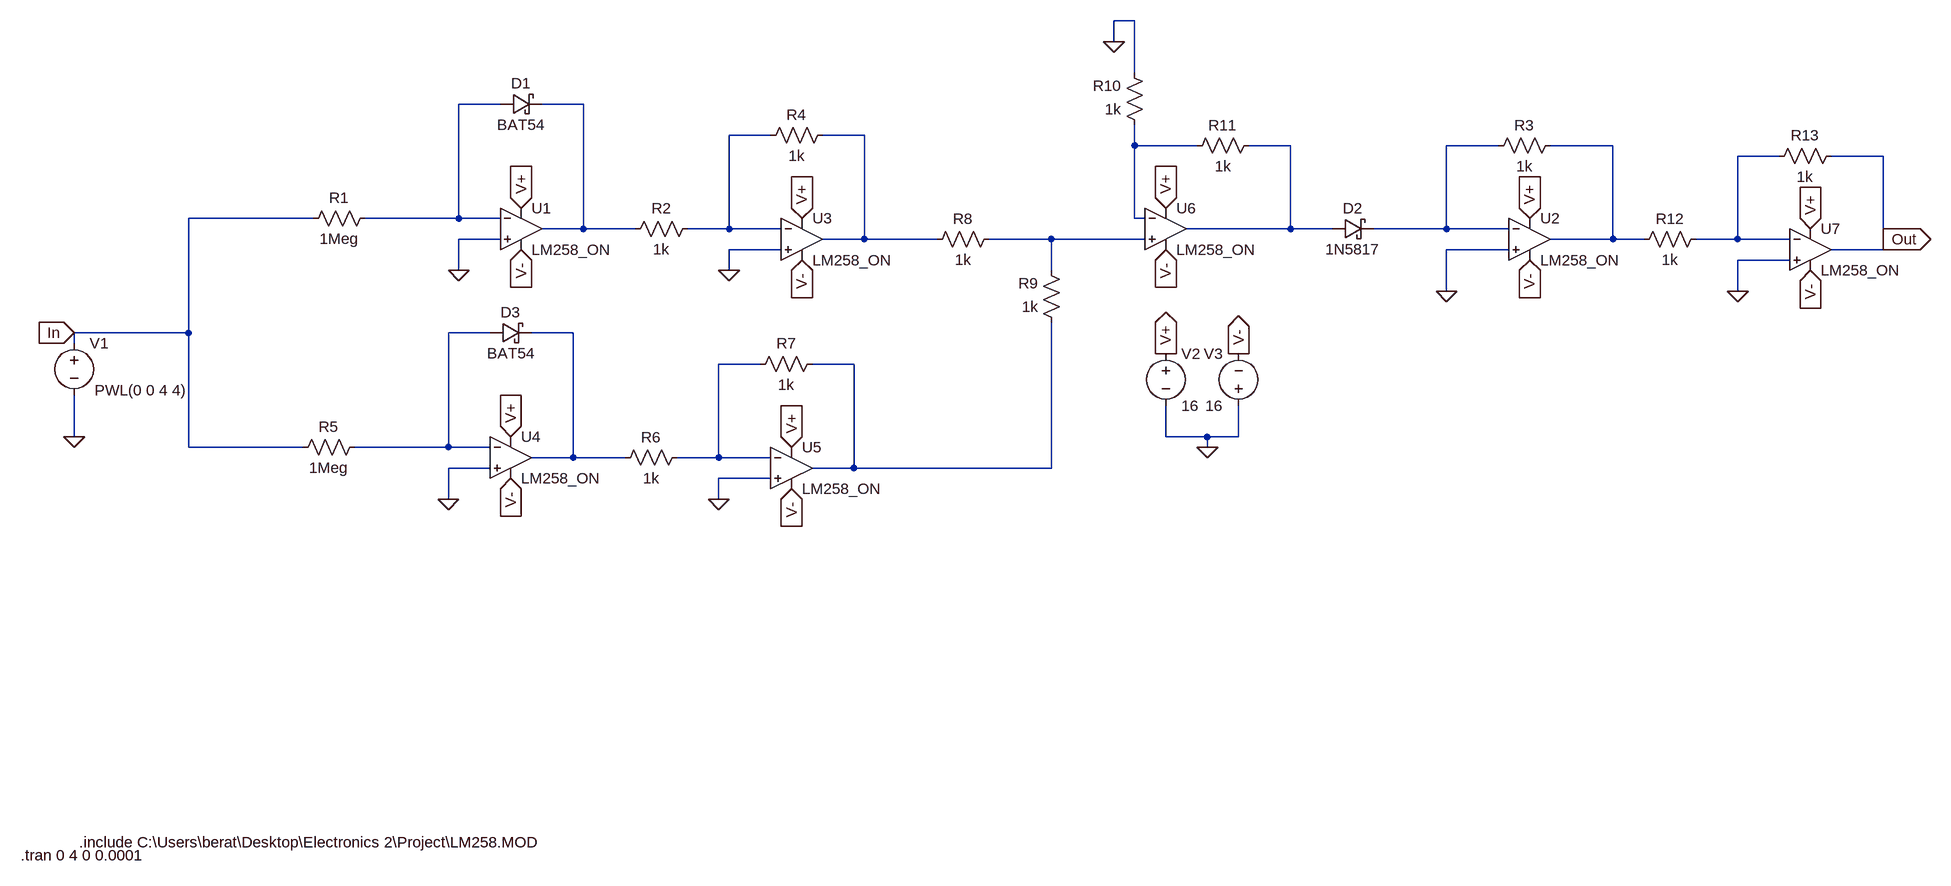
[diagram p0: schematic Draft1.asc]
Draft1.asc, the LTspice schematic file:
Version 4
SHEET 1 2380 680
WIRE 1168 -816 1136 -816
WIRE 1136 -784 1136 -816
WIRE 1168 -736 1168 -816
WIRE 192 -688 128 -688
WIRE 320 -688 256 -688
WIRE 608 -640 544 -640
WIRE 752 -640 688 -640
WIRE 1168 -624 1168 -656
WIRE 1264 -624 1168 -624
WIRE 1408 -624 1344 -624
WIRE 1728 -624 1648 -624
WIRE 1904 -624 1808 -624
WIRE 2160 -608 2096 -608
WIRE 2320 -608 2240 -608
WIRE -96 -512 -288 -512
WIRE 128 -512 128 -688
WIRE 128 -512 -16 -512
WIRE 192 -512 128 -512
WIRE 1168 -512 1168 -624
WIRE 1184 -512 1168 -512
WIRE 320 -496 320 -688
WIRE 320 -496 256 -496
WIRE 400 -496 320 -496
WIRE 544 -496 544 -640
WIRE 544 -496 480 -496
WIRE 624 -496 544 -496
WIRE 1408 -496 1408 -624
WIRE 1408 -496 1248 -496
WIRE 1472 -496 1408 -496
WIRE 1648 -496 1648 -624
WIRE 1648 -496 1536 -496
WIRE 1744 -496 1648 -496
WIRE 192 -480 128 -480
WIRE 752 -480 752 -640
WIRE 752 -480 688 -480
WIRE 864 -480 752 -480
WIRE 1040 -480 944 -480
WIRE 1184 -480 1040 -480
WIRE 1904 -480 1904 -624
WIRE 1904 -480 1808 -480
WIRE 1952 -480 1904 -480
WIRE 2096 -480 2096 -608
WIRE 2096 -480 2032 -480
WIRE 2176 -480 2096 -480
WIRE 2320 -480 2320 -608
WIRE 624 -464 544 -464
WIRE 1744 -464 1648 -464
WIRE 2320 -464 2320 -480
WIRE 2320 -464 2240 -464
WIRE 2176 -448 2096 -448
WIRE 128 -432 128 -480
WIRE 544 -432 544 -464
WIRE 1040 -432 1040 -480
WIRE 1648 -400 1648 -464
WIRE 2096 -400 2096 -448
WIRE -288 -336 -288 -512
WIRE -288 -336 -464 -336
WIRE 176 -336 112 -336
WIRE 304 -336 240 -336
WIRE -464 -320 -464 -336
WIRE 592 -288 528 -288
WIRE 736 -288 672 -288
WIRE -464 -176 -464 -240
WIRE 1216 -176 1216 -224
WIRE 1280 -176 1216 -176
WIRE 1328 -176 1328 -224
WIRE 1328 -176 1280 -176
WIRE -288 -160 -288 -336
WIRE -112 -160 -288 -160
WIRE 112 -160 112 -336
WIRE 112 -160 -32 -160
WIRE 176 -160 112 -160
WIRE 1280 -160 1280 -176
WIRE 304 -144 304 -336
WIRE 304 -144 240 -144
WIRE 384 -144 304 -144
WIRE 528 -144 528 -288
WIRE 528 -144 464 -144
WIRE 608 -144 528 -144
WIRE 176 -128 112 -128
WIRE 736 -128 736 -288
WIRE 736 -128 672 -128
WIRE 1040 -128 1040 -352
WIRE 1040 -128 736 -128
WIRE 608 -112 528 -112
WIRE 112 -80 112 -128
WIRE 528 -80 528 -112
FLAG 1280 -160 0
FLAG 1216 -304 V+
IOPIN 1216 -304 Out
FLAG 1328 -304 V-
IOPIN 1328 -304 Out
FLAG 224 -528 V+
IOPIN 224 -528 In
FLAG 224 -464 V-
IOPIN 224 -464 In
FLAG 1776 -512 V+
IOPIN 1776 -512 In
FLAG 1776 -448 V-
IOPIN 1776 -448 In
FLAG 128 -432 0
FLAG 1648 -400 0
FLAG 656 -512 V+
IOPIN 656 -512 In
FLAG 656 -448 V-
IOPIN 656 -448 In
FLAG 208 -176 V+
IOPIN 208 -176 In
FLAG 208 -112 V-
IOPIN 208 -112 In
FLAG 112 -80 0
FLAG 640 -160 V+
IOPIN 640 -160 In
FLAG 640 -96 V-
IOPIN 640 -96 In
FLAG 544 -432 0
FLAG 528 -80 0
FLAG 1216 -528 V+
IOPIN 1216 -528 In
FLAG 1216 -464 V-
IOPIN 1216 -464 In
FLAG 1136 -784 0
FLAG 2208 -496 V+
IOPIN 2208 -496 In
FLAG 2208 -432 V-
IOPIN 2208 -432 In
FLAG 2096 -400 0
FLAG 2320 -480 Out
IOPIN 2320 -480 Out
FLAG -464 -176 0
FLAG -464 -336 In
IOPIN -464 -336 In
SYMBOL OpAmps\\opamp2 224 -560 R0
SYMATTR InstName U1
SYMATTR Value LM258_ON
SYMBOL voltage 1216 -320 R0
WINDOW 123 0 0 Left 0
WINDOW 39 0 0 Left 0
SYMATTR InstName V2
SYMATTR Value 16
SYMBOL res 0 -528 R90
WINDOW 0 0 56 VBottom 2
WINDOW 3 32 56 VTop 2
SYMATTR InstName R1
SYMATTR Value 1Meg
SYMBOL schottky 192 -672 R270
WINDOW 0 32 32 VTop 2
WINDOW 3 0 32 VBottom 2
SYMATTR InstName D1
SYMATTR Value BAT54
SYMATTR Description Diode
SYMATTR Type diode
SYMBOL res 496 -512 R90
WINDOW 0 0 56 VBottom 2
WINDOW 3 32 56 VTop 2
SYMATTR InstName R2
SYMATTR Value 1k
SYMBOL schottky 1472 -480 R270
WINDOW 0 32 32 VTop 2
WINDOW 3 0 32 VBottom 2
SYMATTR InstName D2
SYMATTR Value 1N5817
SYMATTR Description Diode
SYMATTR Type diode
SYMBOL OpAmps\\opamp2 1776 -544 R0
SYMATTR InstName U2
SYMATTR Value LM258_ON
SYMBOL res 1824 -640 R90
WINDOW 0 0 56 VBottom 2
WINDOW 3 32 56 VTop 2
SYMATTR InstName R3
SYMATTR Value 1k
SYMBOL OpAmps\\opamp2 656 -544 R0
SYMATTR InstName U3
SYMATTR Value LM258_ON
SYMBOL res 704 -656 R90
WINDOW 0 0 56 VBottom 2
WINDOW 3 32 56 VTop 2
SYMATTR InstName R4
SYMATTR Value 1k
SYMBOL OpAmps\\opamp2 208 -208 R0
SYMATTR InstName U4
SYMATTR Value LM258_ON
SYMBOL res -16 -176 R90
WINDOW 0 0 56 VBottom 2
WINDOW 3 32 56 VTop 2
SYMATTR InstName R5
SYMATTR Value 1Meg
SYMBOL schottky 176 -320 R270
WINDOW 0 32 32 VTop 2
WINDOW 3 0 32 VBottom 2
SYMATTR InstName D3
SYMATTR Value BAT54
SYMATTR Description Diode
SYMATTR Type diode
SYMBOL res 480 -160 R90
WINDOW 0 0 56 VBottom 2
WINDOW 3 32 56 VTop 2
SYMATTR InstName R6
SYMATTR Value 1k
SYMBOL OpAmps\\opamp2 640 -192 R0
SYMATTR InstName U5
SYMATTR Value LM258_ON
SYMBOL res 688 -304 R90
WINDOW 0 0 56 VBottom 2
WINDOW 3 32 56 VTop 2
SYMATTR InstName R7
SYMATTR Value 1k
SYMBOL voltage 1328 -208 R180
WINDOW 0 24 96 Left 2
WINDOW 3 24 16 Left 2
WINDOW 123 0 0 Left 0
WINDOW 39 0 0 Left 0
SYMATTR InstName V3
SYMATTR Value 16
SYMBOL res 960 -496 R90
WINDOW 0 0 56 VBottom 2
WINDOW 3 32 56 VTop 2
SYMATTR InstName R8
SYMATTR Value 1k
SYMBOL res 1056 -336 R180
WINDOW 0 36 76 Left 2
WINDOW 3 36 40 Left 2
SYMATTR InstName R9
SYMATTR Value 1k
SYMBOL OpAmps\\opamp2 1216 -560 R0
SYMATTR InstName U6
SYMATTR Value LM258_ON
SYMBOL res 1184 -640 R180
WINDOW 0 36 76 Left 2
WINDOW 3 36 40 Left 2
SYMATTR InstName R10
SYMATTR Value 1k
SYMBOL res 1248 -608 R270
WINDOW 0 32 56 VTop 2
WINDOW 3 0 56 VBottom 2
SYMATTR InstName R11
SYMATTR Value 1k
SYMBOL OpAmps\\opamp2 2208 -528 R0
SYMATTR InstName U7
SYMATTR Value LM258_ON
SYMBOL res 2048 -496 R90
WINDOW 0 0 56 VBottom 2
WINDOW 3 32 56 VTop 2
SYMATTR InstName R12
SYMATTR Value 1k
SYMBOL res 2256 -624 R90
WINDOW 0 0 56 VBottom 2
WINDOW 3 32 56 VTop 2
SYMATTR InstName R13
SYMATTR Value 1k
SYMBOL voltage -464 -336 R0
WINDOW 3 32 88 Left 2
WINDOW 123 0 0 Left 0
WINDOW 39 0 0 Left 0
SYMATTR Value PWL(0 0 4 4)
SYMATTR InstName V1
TEXT -456 448 Left 2 !.include C:\\Users\\berat\\Desktop\\Electronics 2\\Project\\LM258.MOD
TEXT -546 468 Left 2 !.tran 0 4 0 0.0001

The netlist it stands for:
* Draft1.asc
XU1 0 N001 V+ V- N002 LM258_ON  ; pins In+ In- V+ V- OUT
V2 V+ 0 16
R1 N001 In 1Meg
D1 N001 N002 BAT54
R2 N003 N002 1k
D2 N006 N007 1N5817
XU2 0 N007 V+ V- N008 LM258_ON  ; pins In+ In- V+ V- OUT
R3 N008 N007 1k
XU3 0 N003 V+ V- N004 LM258_ON  ; pins In+ In- V+ V- OUT
R4 N004 N003 1k
XU4 0 N011 V+ V- N012 LM258_ON  ; pins In+ In- V+ V- OUT
R5 N011 In 1Meg
D3 N011 N012 BAT54
R6 N013 N012 1k
XU5 0 N013 V+ V- N014 LM258_ON  ; pins In+ In- V+ V- OUT
R7 N014 N013 1k
V3 0 V- 16
R8 N010 N004 1k
R9 N014 N010 1k
XU6 N010 N005 V+ V- N006 LM258_ON  ; pins In+ In- V+ V- OUT
R10 N005 0 1k
R11 N005 N006 1k
XU7 0 N009 V+ V- Out LM258_ON  ; pins In+ In- V+ V- OUT
R12 N009 N008 1k
R13 Out N009 1k
V1 In 0 PWL(0 0 4 4)
.model D D
.lib standard.dio
.include C:\Users\berat\Desktop\Electronics 2\Project\LM258.MOD
.tran 0 4 0 0.0001
.backanno
.end